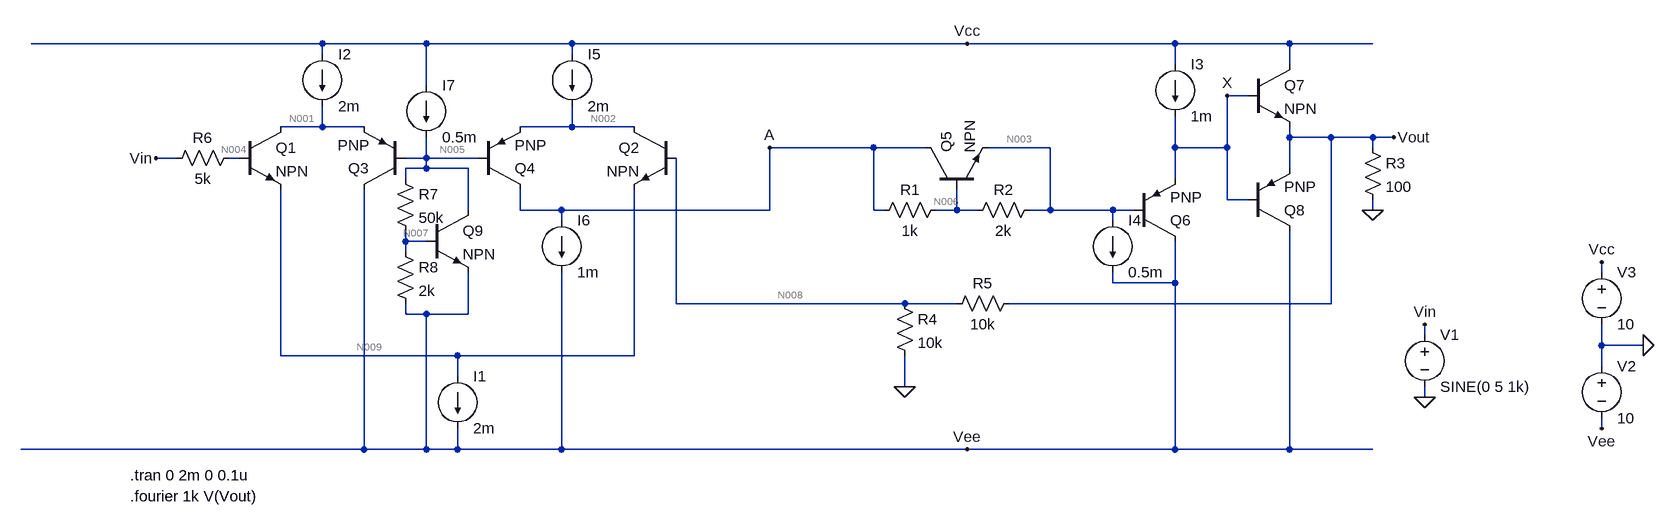
[diagram p0: schematic bak.asc]
bak.asc, the LTspice schematic file:
Version 4
SHEET 1 1744 680
WIRE -304 -240 -752 -240
WIRE -144 -240 -304 -240
WIRE 80 -240 -144 -240
WIRE 688 -240 80 -240
WIRE 1008 -240 688 -240
WIRE 1184 -240 1008 -240
WIRE 1312 -240 1184 -240
WIRE -304 -224 -304 -240
WIRE 80 -224 80 -240
WIRE 1008 -208 1008 -240
WIRE 1184 -208 1184 -240
WIRE -144 -176 -144 -240
WIRE 1120 -160 1088 -160
WIRE -304 -112 -304 -144
WIRE -304 -112 -368 -112
WIRE -240 -112 -304 -112
WIRE 80 -112 80 -144
WIRE 80 -112 0 -112
WIRE 176 -112 80 -112
WIRE 1184 -96 1184 -112
WIRE 1248 -96 1184 -96
WIRE 1312 -96 1248 -96
WIRE 1344 -96 1312 -96
WIRE 544 -80 384 -80
WIRE 624 -80 544 -80
WIRE 816 -80 720 -80
WIRE 1008 -80 1008 -128
WIRE 1088 -80 1088 -160
WIRE 1088 -80 1008 -80
WIRE 1312 -80 1312 -96
WIRE -528 -64 -560 -64
WIRE -432 -64 -448 -64
WIRE -144 -64 -144 -96
WIRE -144 -64 -176 -64
WIRE -64 -64 -144 -64
WIRE -144 -48 -144 -64
WIRE -144 -48 -176 -48
WIRE -80 -48 -144 -48
WIRE 1184 -48 1184 -96
WIRE -176 -32 -176 -48
WIRE 1008 -32 1008 -80
WIRE 1088 0 1088 -80
WIRE 1120 0 1088 0
WIRE -80 16 -80 -48
WIRE 0 16 0 -16
WIRE 64 16 0 16
WIRE 384 16 384 -80
WIRE 384 16 64 16
WIRE 544 16 544 -80
WIRE 560 16 544 16
WIRE 672 16 672 -16
WIRE 672 16 640 16
WIRE 704 16 672 16
WIRE 816 16 816 -80
WIRE 816 16 784 16
WIRE 912 16 816 16
WIRE 944 16 912 16
WIRE 1312 16 1312 0
WIRE 64 32 64 16
WIRE 912 32 912 16
WIRE -176 64 -176 48
WIRE -144 64 -176 64
WIRE -176 80 -176 64
WIRE 1664 112 1664 96
WIRE 912 128 912 112
WIRE 1008 128 1008 64
WIRE 1008 128 912 128
WIRE 240 160 240 -64
WIRE 592 160 240 160
WIRE 672 160 592 160
WIRE 1248 160 1248 -96
WIRE 1248 160 752 160
WIRE -176 176 -176 160
WIRE -144 176 -176 176
WIRE -80 176 -80 112
WIRE -80 176 -144 176
WIRE 1392 208 1392 192
WIRE 1664 224 1664 192
WIRE 1728 224 1664 224
WIRE -368 240 -368 -16
WIRE -96 240 -368 240
WIRE 176 240 176 -16
WIRE 176 240 -96 240
WIRE 1664 256 1664 224
WIRE -96 272 -96 240
WIRE 592 288 592 240
WIRE 1392 304 1392 288
WIRE 1664 352 1664 336
WIRE -240 384 -240 -16
WIRE -240 384 -768 384
WIRE -144 384 -144 176
WIRE -144 384 -240 384
WIRE -96 384 -96 352
WIRE -96 384 -144 384
WIRE 64 384 64 112
WIRE 64 384 -96 384
WIRE 688 384 64 384
WIRE 1008 384 1008 128
WIRE 1008 384 688 384
WIRE 1184 384 1184 48
WIRE 1184 384 1008 384
WIRE 1312 384 1184 384
FLAG 1312 16 0
FLAG 592 288 0
FLAG -560 -64 Vin
FLAG 1344 -96 Vout
FLAG 1728 224 0
FLAG 1664 96 Vcc
FLAG 1664 352 Vee
FLAG 688 384 Vee
FLAG 688 -240 Vcc
FLAG 1392 304 0
FLAG 1392 192 Vin
FLAG 1088 -160 X
FLAG 384 -80 A
SYMBOL npn -432 -112 R0
SYMATTR InstName Q1
SYMBOL npn 240 -112 M0
SYMATTR InstName Q2
SYMBOL npn 624 -16 R270
SYMATTR InstName Q5
SYMBOL res 656 0 R90
WINDOW 0 0 56 VBottom 2
WINDOW 3 32 56 VTop 2
SYMATTR InstName R1
SYMATTR Value 1k
SYMBOL res 800 0 R90
WINDOW 0 0 56 VBottom 2
WINDOW 3 32 56 VTop 2
SYMATTR InstName R2
SYMATTR Value 2k
SYMBOL npn 1120 -208 R0
SYMATTR InstName Q7
SYMBOL pnp 1120 48 M180
SYMATTR InstName Q8
SYMBOL res 1296 -96 R0
SYMATTR InstName R3
SYMATTR Value 100
SYMBOL res 576 144 R0
SYMATTR InstName R4
SYMATTR Value 10k
SYMBOL res 768 144 R90
WINDOW 0 0 56 VBottom 2
WINDOW 3 32 56 VTop 2
SYMATTR InstName R5
SYMATTR Value 10k
SYMBOL current 1008 -208 R0
WINDOW 123 0 0 Left 0
WINDOW 39 0 0 Left 0
SYMATTR InstName I3
SYMATTR Value 1m
SYMBOL current 912 32 R0
WINDOW 123 0 0 Left 0
WINDOW 39 0 0 Left 0
SYMATTR InstName I4
SYMATTR Value 0.5m
SYMBOL res -432 -80 R90
WINDOW 0 0 56 VBottom 2
WINDOW 3 32 56 VTop 2
SYMATTR InstName R6
SYMATTR Value 5k
SYMBOL voltage 1392 192 R0
WINDOW 123 0 0 Left 0
WINDOW 39 0 0 Left 0
SYMATTR InstName V1
SYMATTR Value SINE(0 5 1k)
SYMBOL voltage 1664 240 R0
WINDOW 123 0 0 Left 0
WINDOW 39 0 0 Left 0
SYMATTR InstName V2
SYMATTR Value 10
SYMBOL voltage 1664 96 R0
WINDOW 123 0 0 Left 0
WINDOW 39 0 0 Left 0
SYMATTR InstName V3
SYMATTR Value 10
SYMBOL pnp 944 64 M180
SYMATTR InstName Q6
SYMBOL current -304 -224 R0
WINDOW 123 0 0 Left 0
WINDOW 39 0 0 Left 0
SYMATTR InstName I2
SYMATTR Value 2m
SYMBOL pnp -176 -16 R180
SYMATTR InstName Q3
SYMBOL pnp -64 -16 M180
SYMATTR InstName Q4
SYMBOL current 80 -224 R0
WINDOW 123 0 0 Left 0
WINDOW 39 0 0 Left 0
SYMATTR InstName I5
SYMATTR Value 2m
SYMBOL current 64 32 R0
WINDOW 123 0 0 Left 0
WINDOW 39 0 0 Left 0
SYMATTR InstName I6
SYMATTR Value 1m
SYMBOL current -96 272 R0
WINDOW 123 0 0 Left 0
WINDOW 39 0 0 Left 0
SYMATTR InstName I1
SYMATTR Value 2m
SYMBOL npn -144 16 R0
SYMATTR InstName Q9
SYMBOL res -192 -48 R0
SYMATTR InstName R7
SYMATTR Value 50k
SYMBOL res -192 64 R0
SYMATTR InstName R8
SYMATTR Value 2k
SYMBOL current -144 -176 R0
WINDOW 123 0 0 Left 0
WINDOW 39 0 0 Left 0
SYMATTR InstName I7
SYMATTR Value 0.5m
TEXT -600 424 Left 2 !.tran 0 2m 0 0.1u
TEXT -600 456 Left 2 !.fourier 1k V(Vout)

The netlist it stands for:
* bak.asc
Q1 N001 N004 N009 0 NPN
Q2 N002 N008 N009 0 NPN
Q5 A N006 N003 0 NPN
R1 N006 A 1k
R2 N003 N006 2k
Q7 Vcc X Vout 0 NPN
Q8 Vee X Vout 0 PNP
R3 Vout 0 100
R4 N008 0 10k
R5 Vout N008 10k
I3 Vcc X 1m
I4 N003 Vee 0.5m
R6 N004 Vin 5k
V1 Vin 0 SINE(0 5 1k)
V2 0 Vee 10
V3 Vcc 0 10
Q6 Vee N003 X 0 PNP
I2 Vcc N001 2m
Q3 Vee N005 N001 0 PNP
Q4 A N005 N002 0 PNP
I5 Vcc N002 2m
I6 A Vee 1m
I1 N009 Vee 2m
Q9 N005 N007 Vee 0 NPN
R7 N005 N007 50k
R8 N007 Vee 2k
I7 Vcc N005 0.5m
.model NPN NPN
.model PNP PNP
.lib standard.bjt
.tran 0 2m 0 0.1u
.fourier 1k V(Vout)
.backanno
.end

* Results of the author's LTspice run, read from the files saved beside the schematic
* Operating Point, zero values left out:
*   V(n001) = 9.713 V
*   V(n004) = -74.25 mV
*   V(n009) = -858.7 mV
*   V(n002) = 9.74 V
*   V(n008) = -102.7 mV
*   V(a) = -632.8 mV
*   V(n006) = -994.6 mV
*   V(n003) = -1.716 V
*   V(vcc) = 10 V
*   V(x) = -941.3 mV
*   V(vout) = -155.8 mV
*   V(vee) = -10 V
*   V(n005) = 8.956 V
*   V(n007) = -9.274 V
*   Ic(Q4) = -1.49 mA
*   Ib(Q4) = -14.9 µA
*   Ie(Q4) = 1.505 mA
*   Ic(Q3) = -509.9 µA
*   Ib(Q3) = -5.099 µA
*   Ie(Q3) = 515 µA
*   Ic(Q6) = -1.005 mA
*   Ib(Q6) = -10.05 µA
*   Ie(Q6) = 1.015 mA
*   Ic(Q8) = -1.548 mA
*   Ib(Q8) = -15.48 µA
*   Ie(Q8) = 1.563 mA
*   Ic(Q9) = 155.4 µA
*   Ib(Q9) = 1.554 µA
*   Ie(Q9) = -157 µA
*   Ic(Q7) = 10.94 pA
*   Ib(Q7) = -11.73 pA
*   Ic(Q5) = 128.1 µA
*   Ib(Q5) = 1.281 µA
*   Ie(Q5) = -129.4 µA
*   Ic(Q2) = 495.2 µA
*   Ib(Q2) = 4.952 µA
*   Ie(Q2) = -500.1 µA
*   Ic(Q1) = 1.485 mA
*   Ib(Q1) = 14.85 µA
*   Ie(Q1) = -1.5 mA
*   I(I7) = 500 µA
*   I(I1) = 2 mA
*   I(I6) = 1 mA
*   I(I5) = 2 mA
*   I(I2) = 2 mA
*   I(I4) = 500 µA
*   I(I3) = 1 mA
*   I(R8) = 363 µA
*   I(R7) = 364.6 µA
*   I(R6) = -14.85 µA
*   I(R5) = -5.314 µA
*   I(R4) = -10.27 µA
*   I(R3) = -1.558 mA
*   I(R2) = -360.5 µA
*   I(R1) = -361.8 µA
*   I(V3) = -5.5 mA
*   I(V2) = -7.083 mA
*   I(V1) = -14.85 µA
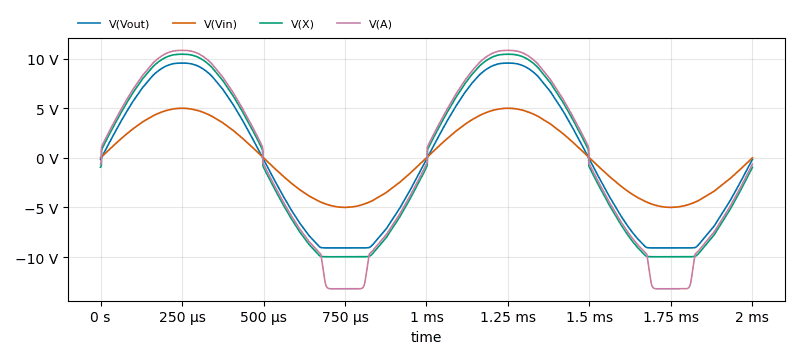
[diagram p1: Transient Analysis of bak.asc, plotted from the saved traces]
* Transient Analysis, 1 run:
*   V(Vout): min -9.088 V, max 9.556 V, average -72.98 mV, rms 6.899 V, last -155.8 mV
*   V(Vin): min -5 V, max 5 V, average 1.347 mV, rms 3.538 V, last 0 V
*   V(X): min -9.979 V, max 10.45 V, average -81.66 mV, rms 7.706 V, last -941.3 mV
*   V(A): min -13.21 V, max 10.84 V, average -224.4 mV, rms 8.391 V, last -632.8 mV
* From the log:
*   N-Period=1
*   Fourier components of V(vout)
*   DC component:-0.0752512
*   Harmonic  Frequency   Fourier   Normalized   Phase    Normalized
*    Number     [Hz]     Component   Component  [degree]  Phase [deg]
*       1     1.000e+03  9.741e+00  1.000e+00     -0.00°      0.00°
*       2     2.000e+03  1.478e-01  1.517e-02    -89.99°    -89.99°
*       3     3.000e+03  2.130e-01  2.187e-02     -0.14°     -0.14°
*       4     4.000e+03  1.106e-01  1.135e-02     89.67°     89.67°
*       5     5.000e+03  1.417e-01  1.455e-02    179.63°    179.63°
*       6     6.000e+03  6.349e-02  6.518e-03    -89.93°    -89.93°
*       7     7.000e+03  7.005e-02  7.192e-03      1.17°      1.17°
*       8     8.000e+03  2.113e-02  2.169e-03     93.25°     93.25°
*       9     9.000e+03  1.661e-02  1.705e-03   -176.35°   -176.35°
*   Total Harmonic Distortion: 3.392456%(3.412202%)